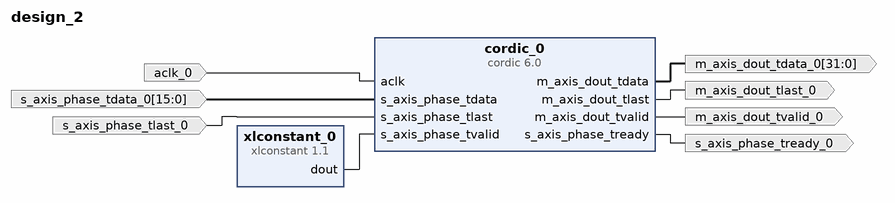
[diagram p0: block diagram of the top level]
# Vivado block design design_2, xczu7ev-ffvc1156-2-e, Vivado 2022.2
create_bd_design design_2

create_bd_port -dir I -type clk aclk_0
set_property -dict {CONFIG.FREQ_HZ 1000000} [get_bd_ports aclk_0]
create_bd_port -dir O m_axis_dout_tvalid_0
create_bd_port -dir O -from 31 -to 0 m_axis_dout_tdata_0
create_bd_port -dir I -from 15 -to 0 s_axis_phase_tdata_0
create_bd_port -dir O s_axis_phase_tready_0
create_bd_port -dir O m_axis_dout_tlast_0
create_bd_port -dir I s_axis_phase_tlast_0

create_bd_cell -type ip -vlnv xilinx.com:ip:cordic:6.0 cordic_0
set_property -dict [list \
  CONFIG.ACLKEN false \
  CONFIG.Architectural_Configuration Parallel \
  CONFIG.Coarse_Rotation true \
  CONFIG.Data_Format SignedFraction \
  CONFIG.Functional_Selection Sin_and_Cos \
  CONFIG.Input_Width 10 \
  CONFIG.Output_Width 10 \
  CONFIG.Pipelining_Mode Maximum \
  CONFIG.flow_control Blocking \
  CONFIG.out_tlast_behv Pass_Phase_TLAST \
  CONFIG.phase_has_tlast true \
] [get_bd_cells cordic_0]
create_bd_cell -type ip -vlnv xilinx.com:ip:xlconstant:1.1 xlconstant_0

# ---- connections ----

connect_bd_net -net aclk_0_1 [get_bd_ports aclk_0] [get_bd_pins cordic_0/aclk]
connect_bd_net [get_bd_pins cordic_0/m_axis_dout_tdata] [get_bd_ports m_axis_dout_tdata_0]
connect_bd_net [get_bd_pins cordic_0/m_axis_dout_tlast] [get_bd_ports m_axis_dout_tlast_0]
connect_bd_net [get_bd_pins cordic_0/m_axis_dout_tvalid] [get_bd_ports m_axis_dout_tvalid_0]
connect_bd_net [get_bd_pins cordic_0/s_axis_phase_tready] [get_bd_ports s_axis_phase_tready_0]
connect_bd_net -net s_axis_phase_tdata_0_1 [get_bd_ports s_axis_phase_tdata_0] [get_bd_pins cordic_0/s_axis_phase_tdata]
connect_bd_net -net s_axis_phase_tlast_0_1 [get_bd_ports s_axis_phase_tlast_0] [get_bd_pins cordic_0/s_axis_phase_tlast]
connect_bd_net [get_bd_pins xlconstant_0/dout] [get_bd_pins cordic_0/s_axis_phase_tvalid]

validate_bd_design
save_bd_design
